# Altium project PCB_Project1.PrjPCB
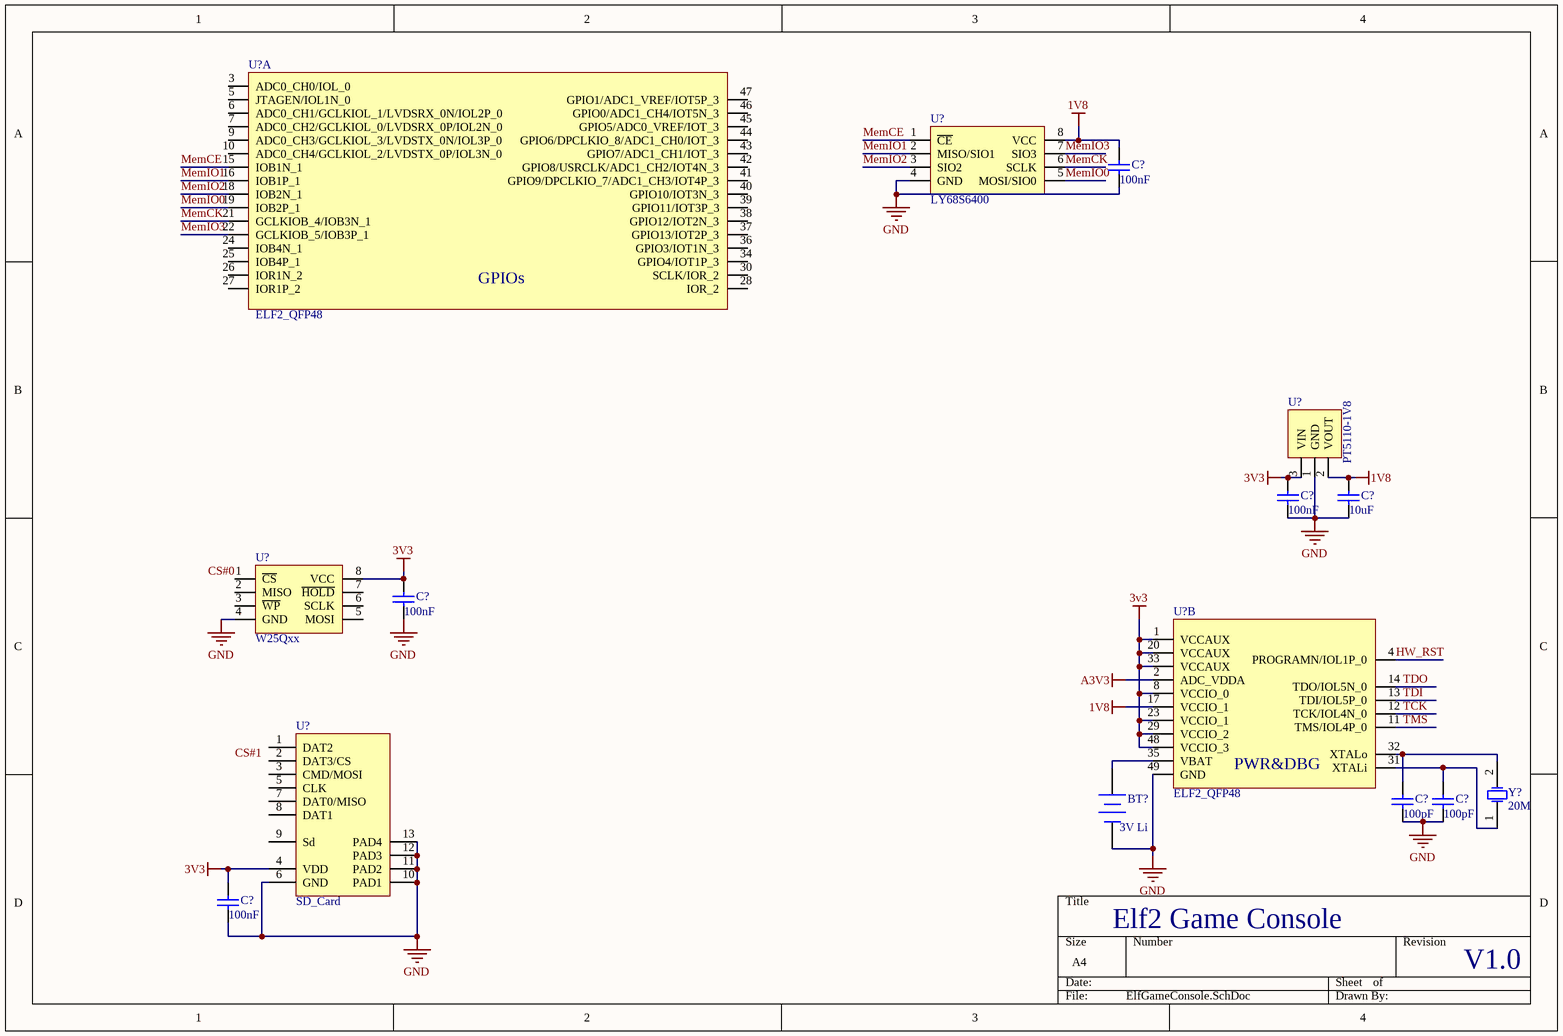
[diagram p0: ElfGameConsole.SchDoc]
1 sheet, 15 parts. Net scope: global (net labels, ports and power ports of the same name join across sheets).
Board file: ElfGameConsole.PcbDoc

## Sheet ElfGameConsole.SchDoc
size A4

### Parts
(Parts that share a designator on the sheet are numbered #1, #2 ... from top to bottom, then left to right.)
BT?  3V Li  [BAT-2]
C?#1  value 100nF  [0603C]  (hidden comment: Cap)
C?#2  value 100nF  [0603C]  (hidden comment: Cap)
C?#3  value 10uF  [0603C]  (hidden comment: Cap)
C?#4  value 100nF  [0603C]  (hidden comment: Cap)
C?#5  value 100pF  [0603C]  (hidden comment: Cap)
C?#6  value 100pF  [0603C]  (hidden comment: Cap)
C?#7  value 100nF  [0603C]  (hidden comment: Cap)
U?#1  ELF2_QFP48  (part A of 2)
U?#2  LY68S6400  [SOP8N-127P600X200]
U?#3  PT5110-1V8  [SOT-89-3]
U?#4  W25Qxx
U?#5  ELF2_QFP48  (part B of 2)
U?#6  SD_Card  [TF_self-eject]
Y?  20M  [XTAL-5032]

### Nets
1V8: C?#1.2 C?#3.2 U?#2.8(VCC) U?#3.2(VOUT) U?#5.17(VCCIO_1)
3V3: C?#2.2 C?#4.2 C?#7.2 U?#3.3(VIN) U?#4.8(VCC) U?#5.1(VCCAUX) U?#5.8(VCCIO_0) U?#5.20(VCCAUX) U?#5.23(VCCIO_1) U?#5.29(VCCIO_2) U?#5.33(VCCAUX) U?#5.48(VCCIO_3) U?#6.4(VDD)
A3V3: U?#5.2(ADC_VDDA)
GND: BT?.2(-) C?#1.1 C?#2.1 C?#3.1 C?#4.1 C?#5.1 C?#6.1 C?#7.1 U?#2.4(GND) U?#3.1(GND) U?#4.4(GND) U?#5.49(GND) U?#6.6(GND) U?#6.10(PAD1) U?#6.11(PAD2) U?#6.12(PAD3) U?#6.13(PAD4)
HW_RST: U?#5.4(PROGRAMN/IOL1P_0)
MemCE: U?#1.15(IOB1N_1) U?#2.1(~{CE})
MemCK: U?#1.21(GCLKIOB_4/IOB3N_1) U?#2.6(SCLK)
MemIO0: U?#1.19(IOB2P_1) U?#2.5(MOSI/SIO0)
MemIO1: U?#1.16(IOB1P_1) U?#2.2(MISO/SIO1)
MemIO2: U?#1.18(IOB2N_1) U?#2.3(SIO2)
MemIO3: U?#1.22(GCLKIOB_5/IOB3P_1) U?#2.7(SIO3)
TCK: U?#5.12(TCK/IOL4N_0)
TDI: U?#5.13(TDI/IOL5P_0)
TDO: U?#5.14(TDO/IOL5N_0)
TMS: U?#5.11(TMS/IOL4P_0)
NetBT?_1: BT?.1(+) U?#5.35(VBAT)
NetC?#5_2: C?#5.2 U?#5.32(XTALo) Y?.2(OSC2)
NetC?#6_2: C?#6.2 U?#5.31(XTALi) Y?.1(OSC1)

Not connected (* = marked no-connect by the designer): U?#1 3(ADC0_CH0/IOL_0) 5(JTAGEN/IOL1N_0) 6(ADC0_CH1/GCLKIOL_1/LVDSRX_0N/IOL2P_0) 7(ADC0_CH2/GCLKIOL_0/LVDSRX_0P/IOL2N_0) 9(ADC0_CH3/GCLKIOL_3/LVDSTX_0N/IOL3P_0) 10(ADC0_CH4/GCLKIOL_2/LVDSTX_0P/IOL3N_0) 24(IOB4N_1) 25(IOB4P_1) 26(IOR1N_2) 27(IOR1P_2) 28(IOR_2) 30(SCLK/IOR_2) 34(GPIO4/IOT1P_3) 36(GPIO3/IOT1N_3) 37(GPIO13/IOT2P_3) 38(GPIO12/IOT2N_3) 39(GPIO11/IOT3P_3) 40(GPIO10/IOT3N_3) 41(GPIO9/DPCLKIO_7/ADC1_CH3/IOT4P_3) 42(GPIO8/USRCLK/ADC1_CH2/IOT4N_3) 43(GPIO7/ADC1_CH1/IOT_3) 44(GPIO6/DPCLKIO_8/ADC1_CH0/IOT_3) 45(GPIO5/ADC0_VREF/IOT_3) 46(GPIO0/ADC1_CH4/IOT5N_3) 47(GPIO1/ADC1_VREF/IOT5P_3); U?#4 1(~{CS}) 2(MISO) 3(~{WP}) 5(MOSI) 6(SCLK) 7(~{HOLD}); U?#6 1(DAT2) 2(DAT3/CS) 3(CMD/MOSI) 5(CLK) 7(DAT0/MISO) 8(DAT1) 9(Sd)

### Notes on the sheet
- Elf2 Game Console
- V1.0
- Labels drawn without touching a wire or pin: CS#0, CS#1
- (in symbol ELF2_QFP48, part A) GPIOs
- (in symbol ELF2_QFP48, part B) PWR&DBG

### Library data of the parts
BT? = Battery: Multicell Battery; Published: 24-Mar-1999; LatestRevisionDate: 17-Jul-2002; LatestRevisionNote: Re-released for DXP Platform.; PackageReference: BAT-2; Publisher: Altium Limited; PackageDescription: Battery; 2 Leads
C?#1-C?#7 = Cap: Capacitor; Published: 8-Jun-2000; LatestRevisionDate: 17-Jul-2002; LatestRevisionNote: Re-released for DXP Platform.; PackageReference: RAD-0.3; Publisher: Altium Limited; PackageDescription: Radial Cap, Thru-Hole; 2 Leads; 0.3 in Pin Spacing
U?#2 = LY68x6400
U?#3 = PT5110
Y? = XTAL: Crystal Oscillator; Published: 8-Jun-2000; LatestRevisionDate: 17-Jul-2002; LatestRevisionNote: Re-released for DXP Platform.; PackageReference: R38; Publisher: Altium Limited; PackageDescription: Crystal, Thru-Hole; 2 Leads; Body 3.1 x 8.2 mm (Dia.xH)